# EAGLE schematic Remote (EAGLE 9.6.2)
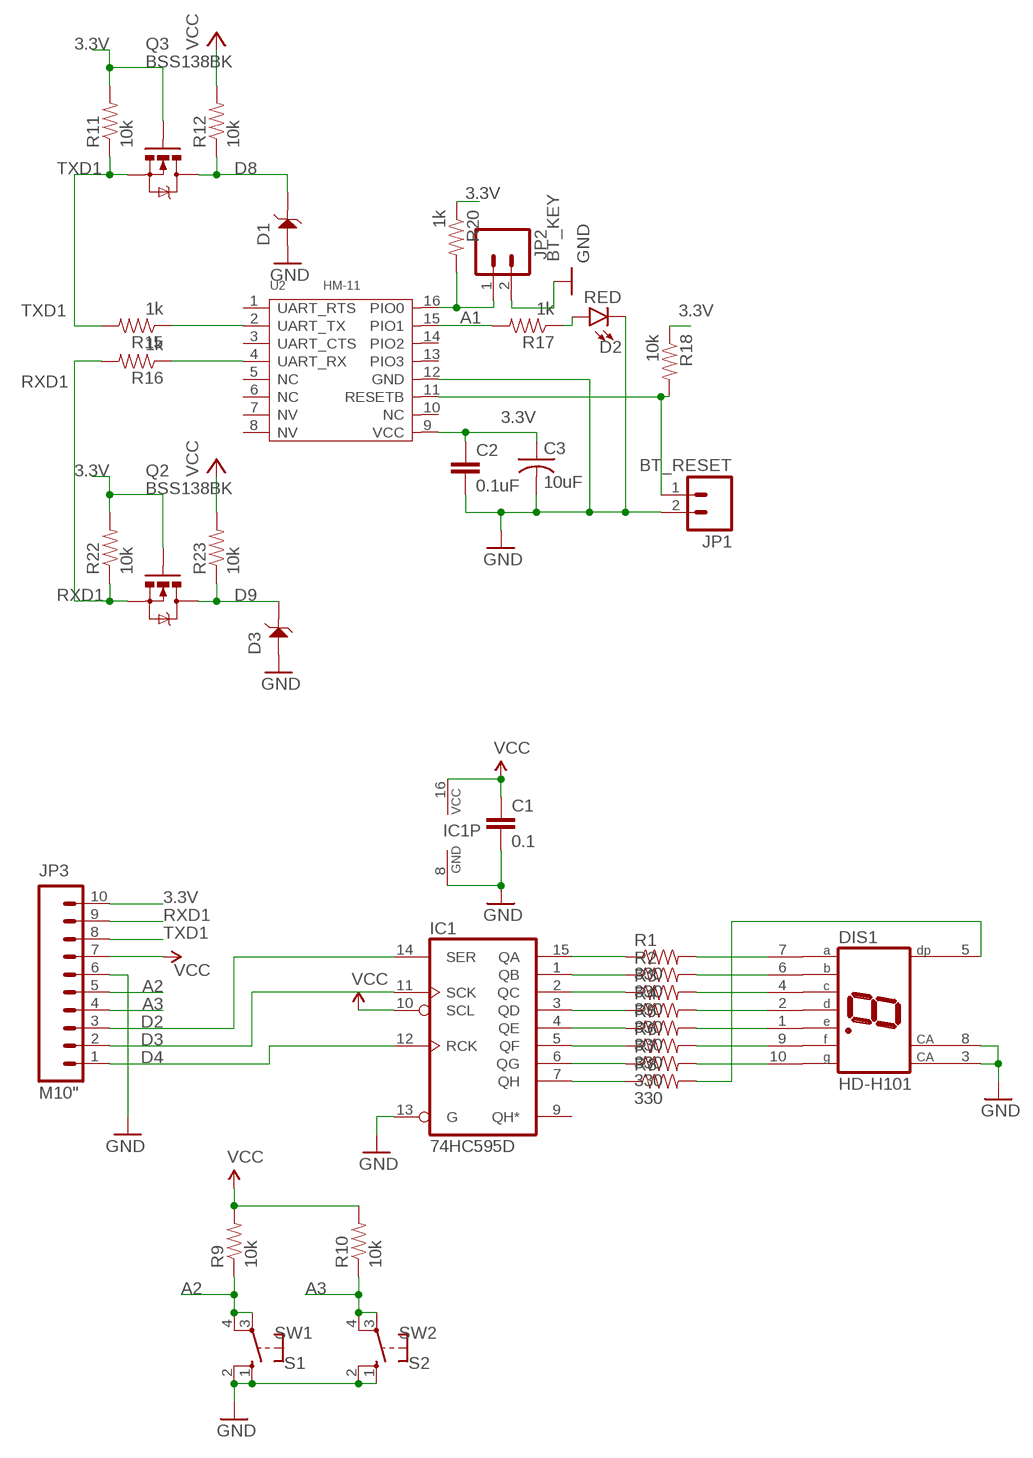
[diagram p0: schematic, sheet 1]

## Parts
C1  0.1  CAP0805  [0805]
C2  0.1uF  CAP0805  [0805]
C3  10uF  C-USC1206  [C1206]
D1  SMF5.0A  D-ESD-2P'CESD5V0D1'  [SOD123-2.7X1.6]
D2  RED  LED-RED0603  [LED-0603]
D3  SMF5.0A  D-ESD-2P'CESD5V0D1'  [SOD123-2.7X1.6]
DIS1  HD-H101  [HDSP-M]
IC1  74HC595D  [SO16]
JP1  BT_RESET  M02PTH  [1X02]
JP2  BT_KEY  M02PTH  [1X02]
JP3  M10"  [1X10]
Q2  BSS138BK  MOSFET-NCHANNELBSS138  [SOT23-3]
Q3  BSS138BK  MOSFET-NCHANNELBSS138  [SOT23-3]
R1  330  RESISTOR0805-RES  [0805]
R2  330  RESISTOR0805-RES  [0805]
R3  330  RESISTOR0805-RES  [0805]
R4  330  RESISTOR0805-RES  [0805]
R5  330  RESISTOR0805-RES  [0805]
R6  330  RESISTOR0805-RES  [0805]
R7  330  RESISTOR0805-RES  [0805]
R8  330  RESISTOR0805-RES  [0805]
R9  10k  RESISTOR0805-RES  [0805]
R10  10k  RESISTOR0805-RES  [0805]
R11  10k  RESISTOR0805-RES  [0805]
R12  10k  RESISTOR0805-RES  [0805]
R15  1k  RESISTOR0805-RES  [0805]
R16  1k  RESISTOR0805-RES  [0805]
R17  1k  RESISTOR0805-RES  [0805]
R18  10k  RESISTOR0805-RES  [0805]
R20  1k  RESISTOR0805-RES  [0805]
R22  10k  RESISTOR0805-RES  [0805]
R23  10k  RESISTOR0805-RES  [0805]
S1  SW1  10-XX  [B3F-10XX]
S2  SW2  10-XX  [B3F-10XX]
U2  HM-11  [16P-18.5X13.5X0.8]

## Nets
3.3V: C2.1 C3.1 JP3.10 Q2.1(G) Q3.1(G) R11.2 R18.1 R20.1 R22.2 U2.9(VCC)
A1: R17.2 U2.15(PIO1)
A2: JP3.5 R9.1 S1.3(P) S1.4(P1)
A3: JP3.4 R10.1 S2.3(P) S2.4(P1)
D2: IC1.14(SER) JP3.3
D3: IC1.11(SCK) JP3.2
D4: IC1.12(RCK) JP3.1
D8: D1.2 Q3.3(D) R12.1
D9: D3.2 Q2.3(D) R23.1
GND: C1.2 C2.2 C3.2 D1.1 D2.C D3.1 DIS1.3(CA) DIS1.8(CA) IC1.8(GND) IC1.13(G) JP1.2 JP2.2 JP3.6 S1.1(S) S1.2(S1) S2.1(S) S2.2(S1) U2.12(GND)
N$1: IC1.15(QA) R1.1
N$2: IC1.1(QB) R2.1
N$3: DIS1.5(DP) R8.2
N$4: IC1.2(QC) R3.1
N$5: IC1.3(QD) R4.1
N$6: IC1.4(QE) R5.1
N$7: IC1.5(QF) R6.1
N$8: IC1.6(QG) R7.1
N$9: IC1.7(QH) R8.1
N$10: R15.1 U2.2(UART_TX)
N$11: R16.1 U2.4(UART_RX)
N$12: DIS1.7(A) R1.2
N$13: DIS1.6(B) R2.2
N$14: DIS1.4(C) R3.2
N$15: DIS1.2(D) R4.2
N$16: DIS1.1(E) R5.2
N$17: DIS1.9(F) R6.2
N$18: DIS1.10(G) R7.2
N$19: D2.A R17.1
N$20: JP1.1 R18.2 U2.11(RESETB)
N$22: JP2.1 R20.2 U2.16(PIO0)
RXD1: JP3.9 Q2.2(S) R16.2 R22.1
TXD1: JP3.8 Q3.2(S) R11.1 R15.2
VCC: C1.1 IC1.10(SCL) IC1.16(VCC) JP3.7 R9.2 R10.2 R12.2 R23.2
Unconnected: IC1.9(QH*) U2.1(UART_RTS) U2.3(UART_CTS) U2.5(NC) U2.6(NC) U2.7(NV) U2.8(NV) U2.10(NC) U2.13(PIO3) U2.14(PIO2)

## Library data of the parts
C1 = SparkFun:CAP: Capacitor Standard 0603 ceramic capacitor, and 0.1" leaded capacitor.
C2 = SparkFun-Capacitors:CAP: Capacitor Standard 0603 ceramic capacitor, and 0.1" leaded capacitor.
C3 = adafruit:C-US: CAPACITOR, American symbol
D1 D3 = discrete:D-ESD-2P: Diodes for Protectiong against ESD
D2 = SparkFun-LED:LED-RED: Red SMD LED Used in manufacturing of most products at SparkFun Packages: 0603 - SMD 0603 package [Product Link] <http://docs.avagotech.com/docs/AV02-0551EN> 0603 SMART - SMD 0603 SMART package ( more efficient and expensive)[Product Link] <http://www.osram-os.com/Graphics/XPic2/00077099_0.pdf> 1206 - SMD1206 package [Product Link] <https://www.sparkfun.com/datasheets/DevTools/LilyPad/Q150OVS4.pdff> SparkFun Products: Pro Mini 328 -5V <https://www.sparkfun.com/products/821> RedBoard <https://www.sparkfun.com/products/12757> IOIO-OTG <https://www.sparkfun.com/products/13613>; PROD_ID: DIO-00819
DIS1 = display-hp:HD-H101: LED DISPLAY 1-character 7 segment, decimal point right; OC_FARNELL: unknown; OC_NEWARK: unknown
IC1 = 74xx-eu:74*595: 8-bit SHIFT REGISTER, output latch
JP1 JP2 = SparkFun:M02: Header 2 Standard 2-pin 0.1" header. Use with straight break away headers (SKU : PRT-00116), right angle break away headers (PRT-00553), swiss pins (PRT-00743), machine pins (PRT-00117), and female headers (PRT-00115). Molex polarized connector foot print use with SKU : PRT-08233 with associated crimp pins and housings.
JP3 = SparkFun-Connectors:M10: Header 10 Standard 10-pin 0.1" header. Use with straight break away headers (SKU : PRT-00116), right angle break away headers (PRT-00553), swiss pins (PRT-00743), machine pins (PRT-00117), and female headers (PRT-00115).
Q2 Q3 = SparkFun-DiscreteSemi:MOSFET-NCHANNEL: Common NMOSFET Parts MFG P/N Store ID Prod ID FDD8780 TRANS-09984 SI7820DN TRANS-11055 FDS6630A IC-08089 2N7002PW TRANS-11151 FQP30N06L COM-10213 TRANS-10060 BSS123LT1G TRANS-08345 BSS138 TRANS-00830 BS170 2N7000; PROD_ID: TRANS-00830; VALUE: 200mA/50V
R1-R12 R15-R18 R20 R22 R23 = SparkFun-Resistors:RESISTOR: Resistor Basic schematic elements and footprints for 0603, 1206, and PTH resistors.
S1 S2 = switch-omron:10-XX: OMRON SWITCH; MPN: B3F-1000; OC_FARNELL: 176432; OC_NEWARK: 36M3542
U2 = template:HM-11: Bluetooth Specification V4.0 BLE